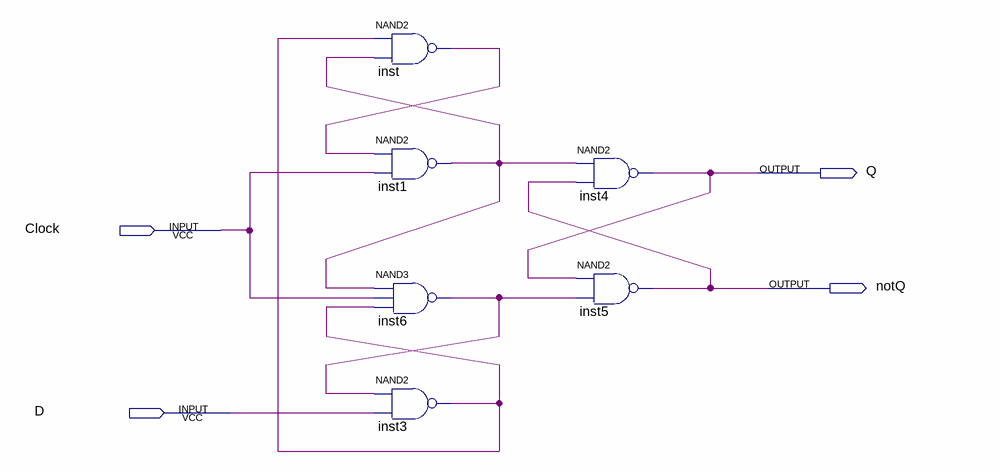
[diagram p0: schematic sheet]
// Quartus schematic D_FLIPFLOP.bdf as structural Verilog: 6 symbols, 4 pins
module D_FLIPFLOP (
  input  Clock,
  input  D,
  output Q,
  output notQ
);

  wire inst1_out, inst3_out, inst6_out, inst_out;

  nand inst (inst_out, inst3_out, inst1_out);
  nand inst1 (inst1_out, inst_out, Clock);
  nand inst6 (inst6_out, inst1_out, Clock, inst3_out);
  nand inst3 (inst3_out, inst6_out, D);
  nand inst4 (Q, inst1_out, notQ);
  nand inst5 (notQ, Q, inst6_out);
endmodule
